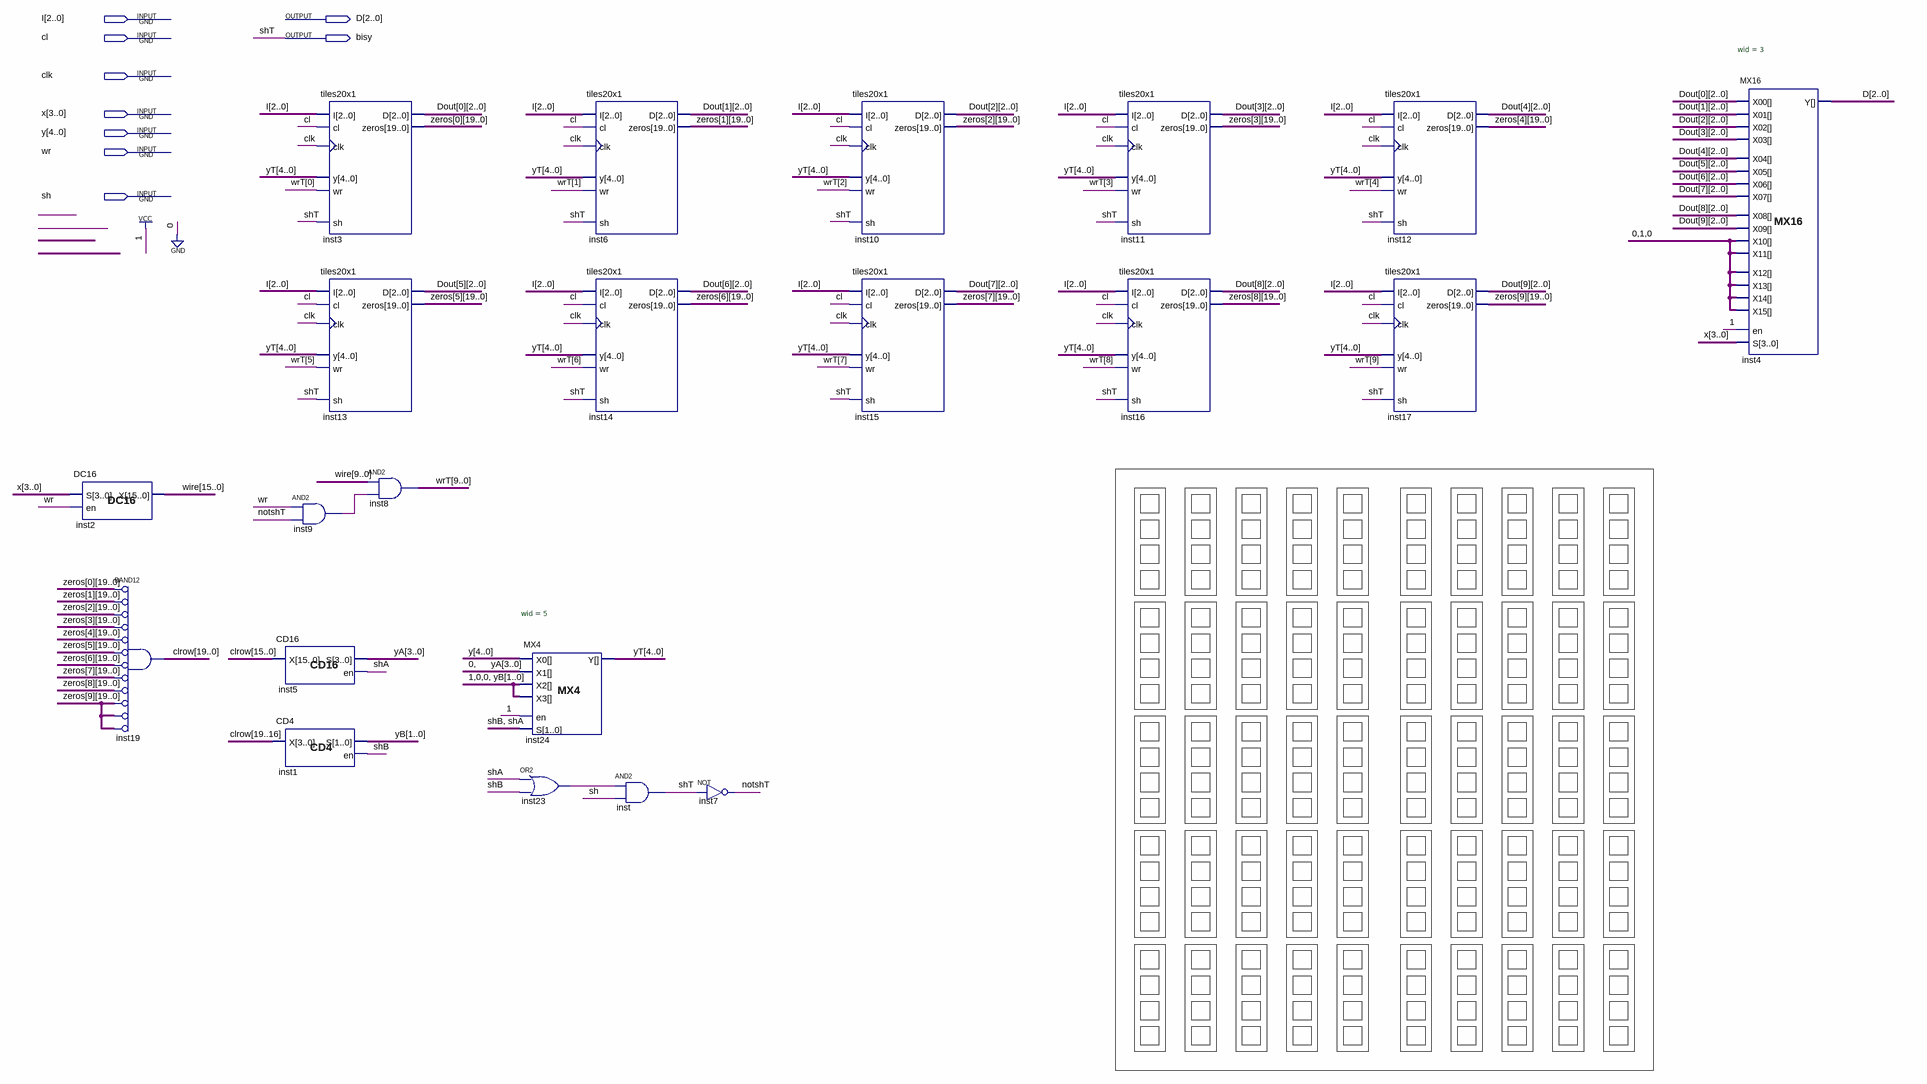
[diagram p0: schematic sheet]
// Quartus schematic tiles20x10.bdf as structural Verilog: 21 symbols, 9 pins
module tiles20x10 (
  input  [2:0] I,
  input  cl,
  input  clk,
  input  [3:0] x,
  input  [4:0] y,
  input  wr,
  input  sh,
  output [2:0] D,
  output bisy
);

  wire inst9_out, inst23_out, notshT, shA, shB;
  wire [1:0] yB;
  wire [2:0] Dout_0, Dout_1, Dout_2, Dout_3, Dout_4, Dout_5, Dout_6, Dout_7, Dout_8, Dout_9;
  wire [3:0] yA;
  wire [4:0] yT;
  wire [9:0] wrT;
  wire [15:0] \wire ;
  wire [19:0] clrow, zeros_0, zeros_1, zeros_2, zeros_3, zeros_4, zeros_5, zeros_6, zeros_7, zeros_8, zeros_9;

  DC16 inst2 (.S(x), .en(wr), .X(\wire ));
  assign clrow = ~zeros_0 & ~zeros_1 & ~zeros_2 & ~zeros_3 & ~zeros_4 & ~zeros_5 & ~zeros_6 & ~zeros_7 & ~zeros_8 & ~zeros_9 & ~zeros_9 & ~zeros_9;  // BAND12 inst19, 20 bits wide
  CD16 inst5 (.X(clrow[15:0]), .S(yA), .en(shA));
  CD4 inst1 (.X(clrow[19:16]), .S(yB), .en(shB));
  tiles20x1 inst3 (.I(I), .cl(cl), .clk(clk), .y(yT), .wr(wrT[0]), .sh(bisy), .D(Dout_0), .zeros(zeros_0));
  tiles20x1 inst13 (.I(I), .cl(cl), .clk(clk), .y(yT), .wr(wrT[5]), .sh(bisy), .D(Dout_5), .zeros(zeros_5));
  and inst9 (inst9_out, wr, notshT);
  assign wrT = \wire [9:0] & {10{inst9_out}};  // AND2 inst8, 10 bits wide
  MX4 #(.wid(5)) inst24 (
    .X0(y), .X1({1'b0, yA}), .X2({3'b100, yB}), .X3({3'b100, yB}), .en(1'b1), .S({shB, shA}), .Y(yT));
  or inst23 (inst23_out, shA, shB);
  tiles20x1 inst6 (.I(I), .cl(cl), .clk(clk), .y(yT), .wr(wrT[1]), .sh(bisy), .D(Dout_1), .zeros(zeros_1));
  tiles20x1 inst14 (.I(I), .cl(cl), .clk(clk), .y(yT), .wr(wrT[6]), .sh(bisy), .D(Dout_6), .zeros(zeros_6));
  and inst (bisy, inst23_out, sh);
  not inst7 (notshT, bisy);
  tiles20x1 inst10 (.I(I), .cl(cl), .clk(clk), .y(yT), .wr(wrT[2]), .sh(bisy), .D(Dout_2), .zeros(zeros_2));
  tiles20x1 inst15 (.I(I), .cl(cl), .clk(clk), .y(yT), .wr(wrT[7]), .sh(bisy), .D(Dout_7), .zeros(zeros_7));
  tiles20x1 inst11 (.I(I), .cl(cl), .clk(clk), .y(yT), .wr(wrT[3]), .sh(bisy), .D(Dout_3), .zeros(zeros_3));
  tiles20x1 inst16 (.I(I), .cl(cl), .clk(clk), .y(yT), .wr(wrT[8]), .sh(bisy), .D(Dout_8), .zeros(zeros_8));
  tiles20x1 inst12 (.I(I), .cl(cl), .clk(clk), .y(yT), .wr(wrT[4]), .sh(bisy), .D(Dout_4), .zeros(zeros_4));
  tiles20x1 inst17 (.I(I), .cl(cl), .clk(clk), .y(yT), .wr(wrT[9]), .sh(bisy), .D(Dout_9), .zeros(zeros_9));
  MX16 #(.wid(3)) inst4 (
    .X00(Dout_0), .X01(Dout_1), .X02(Dout_2), .X03(Dout_3), .X04(Dout_4), .X05(Dout_5), .X06(Dout_6),
    .X07(Dout_7), .X08(Dout_8), .X09(Dout_9), .X10(3'b010), .X11(3'b010), .X12(3'b010), .X13(3'b010),
    .X14(3'b010), .X15(3'b010), .en(1'b1), .S(x), .Y(D));

  // Other names for the same wires on the sheet: shT = bisy
endmodule
